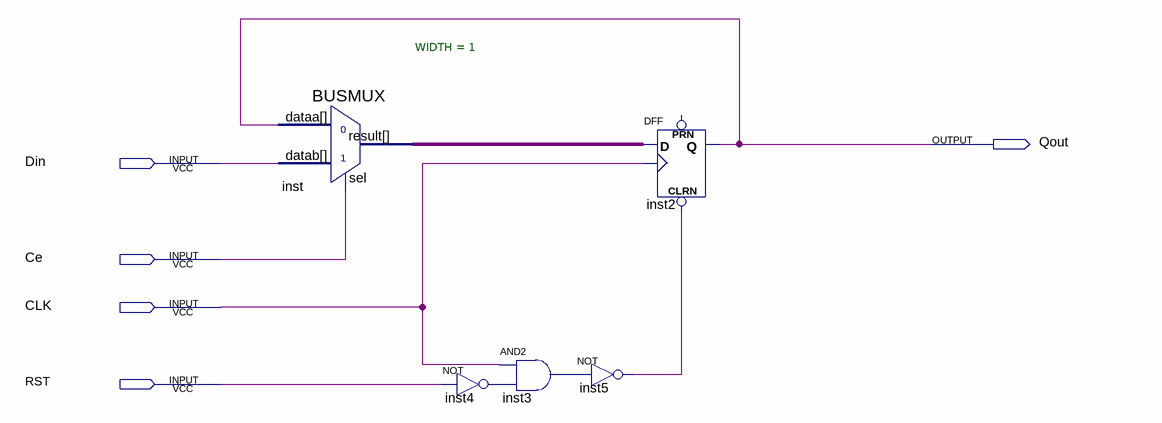
[diagram p0: schematic sheet]
// Quartus schematic dff_synchronous_reset_clock_enable.bdf as structural Verilog: 5 symbols, 5 pins
module dff_synchronous_reset_clock_enable (
  input  Din,
  input  Ce,
  input  CLK,
  input  RST,
  output Qout
);

  wire inst3_out, inst4_out, inst5_out, inst_result;

  BUSMUX #(.WIDTH(1)) inst (.datab(Din), .sel(Ce), .dataa(Qout), .result(inst_result));
  not inst4 (inst4_out, RST);
  and inst3 (inst3_out, CLK, inst4_out);
  not inst5 (inst5_out, inst3_out);
  DFF inst2 (.CLRN(inst5_out), .CLK(CLK), .D(inst_result), .Q(Qout));  // open: PRN
endmodule
